# Altium schematic sheet [07]User Interface.SchDoc
size A4; Organization: Altium Limited; Address1: L3, 12a Rodborough Rd; Address2: Frenchs Forest; Address3: NSW; Address4: Australia 2086
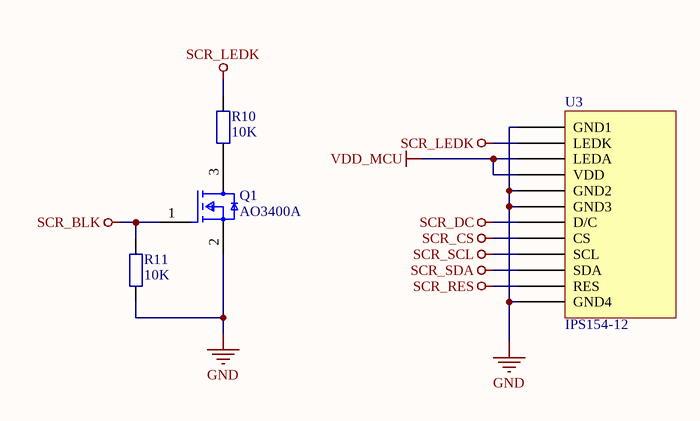
[diagram p0: [07]User Interface.SchDoc]

## Parts
Q1  AO3400A  [FP-SOT23-MFG]
R10  10K  [RESC1005L]
R11  10K  [RESC1005L]
U3  IPS154-12  [ZJY154T-PG04 FPC 0.7mm]

## Nets
GND: Q1.2(S) R11.2 U3.1(GND1) U3.5(GND2) U3.6(GND3) U3.12(GND4)
SCR_BLK: Q1.1(G) R11.1
SCR_CS: U3.8(CS)
SCR_DC: U3.7(D/C)
SCR_LEDK: R10.1 U3.2(LEDK)
SCR_RES: U3.11(RES)
SCR_SCL: U3.9(SCL)
SCR_SDA: U3.10(SDA)
VDD_MCU: U3.3(LEDA) U3.4(VDD)
NetQ1_3: Q1.3(D) R10.2

## Notes on the sheet
- Title
- Size:
- Date:
- A3
- Number:
- Time:
- Revision:
- Sheet
- of
- File:

## Library data of the parts
Q1 = CMP-83955-000006-1: MOSFET N-CH 30V 5.7A SOT23; Input Capacitance: 630pF; Number of Elements: 1; Rds On Max: 26.5mR; Max Power Dissipation: 1.4W; Gate to Source Voltage (Vgs): 12V; Min Operating Temperature: -55°C; Lead Free: Lead Free; Number of Pins: 3; Drain to Source Voltage (Vdss): 30V; Case/Package: SOT-23; Mount: Surface Mount; Continuous Drain Current (ID): 5.7A; Radiation Hardening: No; Packaging: Tape and Reel; Max Operating Temperature: 150°C; Power Dissipation: 1.4W
R10 R11 = RES_CHP: Surface Mount Resistor